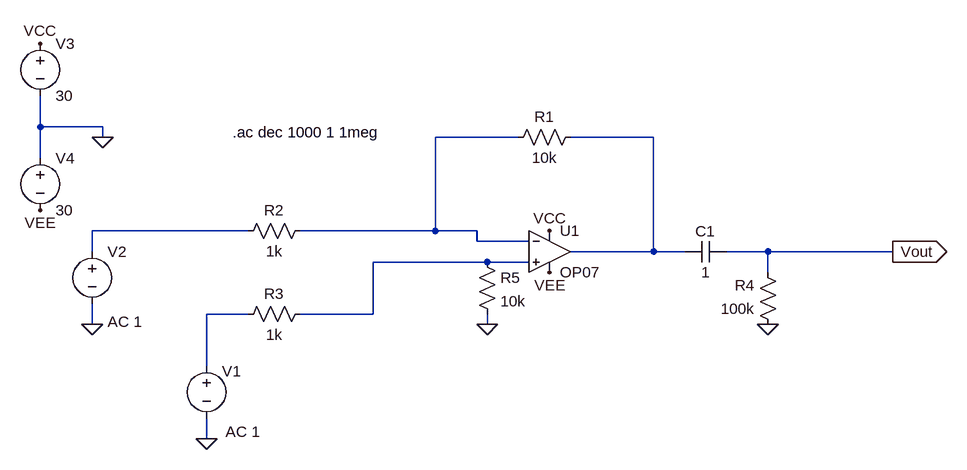
[diagram p0: schematic IdealOPamp_subtractor_input_impedance.asc]
IdealOPamp_subtractor_input_impedance.asc, the LTspice schematic file:
Version 4
SHEET 1 880 680
WIRE -560 -16 -560 -64
WIRE -464 -16 -560 -16
WIRE -464 0 -464 -16
WIRE 176 0 48 0
WIRE 384 0 256 0
WIRE -560 32 -560 -16
WIRE -240 144 -480 144
WIRE 48 144 48 0
WIRE 48 144 -160 144
WIRE 112 144 48 144
WIRE 112 160 112 144
WIRE 192 160 112 160
WIRE -480 176 -480 144
WIRE 384 176 384 0
WIRE 384 176 256 176
WIRE 432 176 384 176
WIRE 560 176 496 176
WIRE 752 176 560 176
WIRE 128 192 -48 192
WIRE 192 192 128 192
WIRE 560 208 560 176
WIRE -240 272 -304 272
WIRE -48 272 -48 192
WIRE -48 272 -160 272
WIRE -480 288 -480 256
WIRE 128 288 128 272
WIRE -304 352 -304 272
WIRE -304 464 -304 432
FLAG 752 176 Vout
IOPIN 752 176 Out
FLAG -464 0 0
FLAG -560 -144 VCC
FLAG 224 144 VCC
FLAG -560 112 VEE
FLAG 224 208 VEE
FLAG -480 288 0
FLAG -304 464 0
FLAG 128 288 0
FLAG 560 288 0
SYMBOL res 272 -16 R90
WINDOW 0 0 56 VBottom 2
WINDOW 3 32 56 VTop 2
SYMATTR InstName R1
SYMATTR Value 10k
SYMBOL res -144 128 R90
WINDOW 0 0 56 VBottom 2
WINDOW 3 32 56 VTop 2
SYMATTR InstName R2
SYMATTR Value 1k
SYMBOL res -144 256 R90
WINDOW 0 0 56 VBottom 2
WINDOW 3 32 56 VTop 2
SYMATTR InstName R3
SYMATTR Value 1k
SYMBOL voltage -304 336 R0
WINDOW 0 24 24 Left 2
WINDOW 3 29 89 Left 2
WINDOW 123 29 117 Left 2
WINDOW 39 0 0 Left 0
SYMATTR InstName V1
SYMATTR Value ""
SYMATTR Value2 AC 1
SYMBOL voltage -480 160 R0
WINDOW 123 24 124 Left 2
WINDOW 39 0 0 Left 0
SYMATTR Value2 AC 1
SYMATTR InstName V2
SYMATTR Value ""
SYMBOL Opamps\\OP07 224 112 R0
SYMATTR InstName U1
SYMBOL voltage -560 -160 R0
WINDOW 123 0 0 Left 0
WINDOW 39 0 0 Left 0
SYMATTR InstName V3
SYMATTR Value 30
SYMBOL voltage -560 16 R0
WINDOW 123 0 0 Left 0
WINDOW 39 0 0 Left 0
SYMATTR InstName V4
SYMATTR Value 30
SYMBOL res 576 304 R180
WINDOW 0 36 76 Left 2
WINDOW 3 36 40 Left 2
SYMATTR InstName R4
SYMATTR Value 100k
SYMBOL cap 496 160 R90
WINDOW 0 0 32 VBottom 2
WINDOW 3 32 32 VTop 2
SYMATTR InstName C1
SYMATTR Value 1
SYMBOL res 112 176 R0
SYMATTR InstName R5
SYMATTR Value 10k
TEXT -264 -8 Left 2 !.ac dec 1000 1 1meg

The netlist it stands for:
* IdealOPamp_subtractor_input_impedance.asc
R1 N002 N001 10k
R2 N001 N003 1k
R3 N004 N005 1k
V1 N005 0 AC 1
V2 N003 0 AC 1
XU1 N004 N001 VCC VEE N002 LT1001  ; OP07, pins In+ In- V+ V- OUT
V3 VCC 0 30
V4 0 VEE 30
R4 0 Vout 100k
C1 Vout N002 1
R5 N004 0 10k
.ac dec 1000 1 1meg
.lib LTC.lib
.backanno
.end